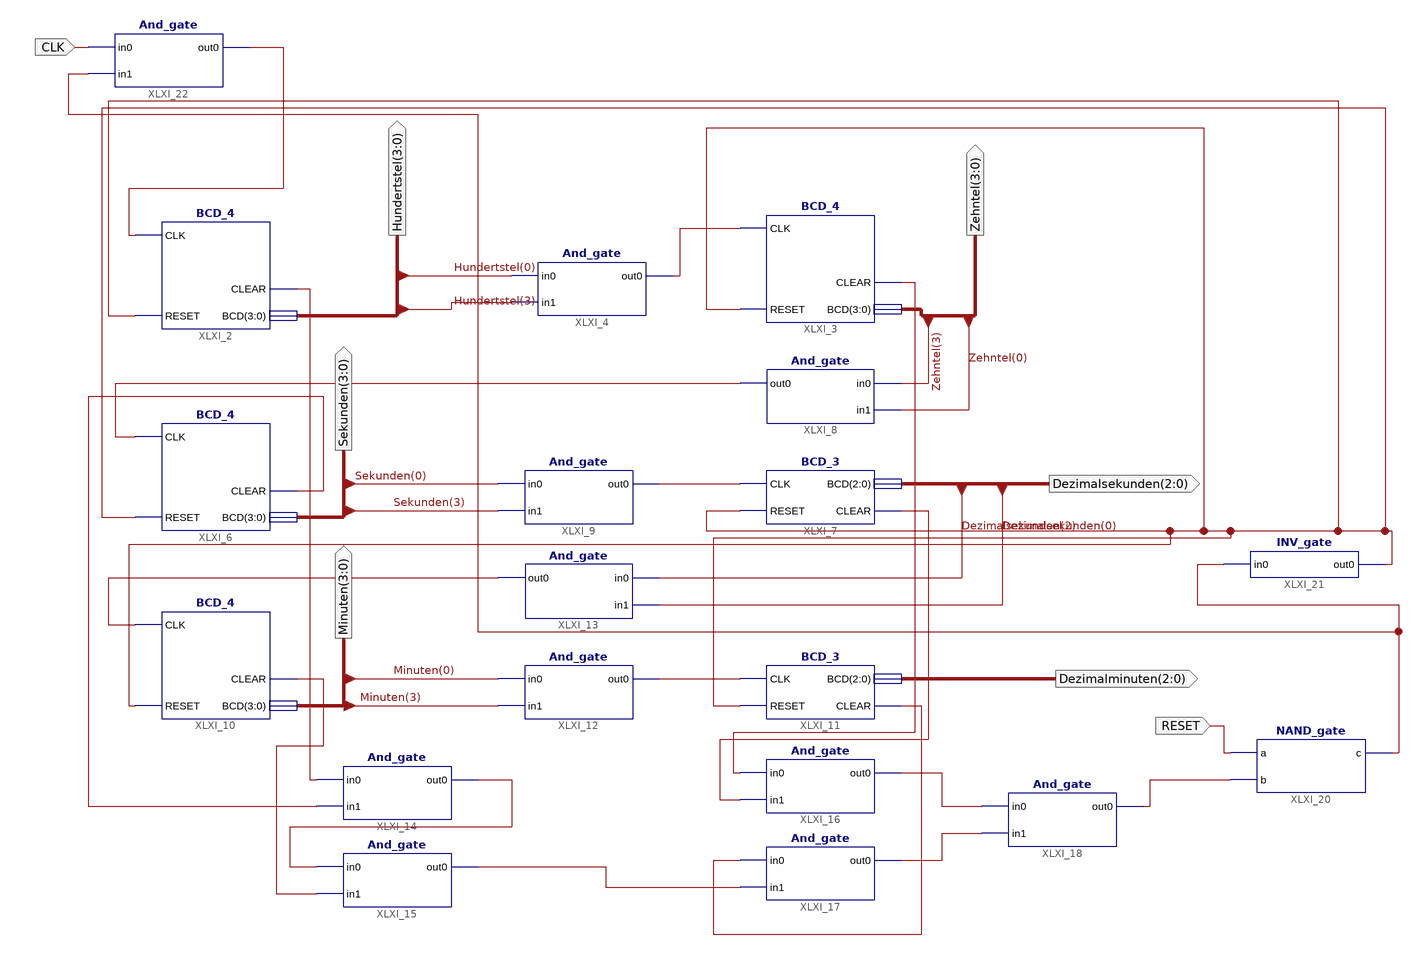
[diagram p0: schematic sheet 1]
// Xilinx ISE schematic Stoppuhr.sch (spartan6) as structural Verilog: 19 symbols, 8 ports
module Stoppuhr (
  input  RESET,
  input  CLK,
  output [3:0] Hundertstel,
  output [3:0] Zehntel,
  output [3:0] Sekunden,
  output [2:0] Dezimalsekunden,
  output [3:0] Minuten,
  output [2:0] Dezimalminuten
);

  wire CLEAR, XLXN_51, XLXN_52, XLXN_53, XLXN_54, XLXN_55, XLXN_56, XLXN_57, XLXN_58, XLXN_59, XLXN_60,
       XLXN_75, XLXN_76, XLXN_77, XLXN_78, XLXN_80, XLXN_102, XLXN_103, XLXN_106;

  BCD_4 XLXI_2 (.CLK(XLXN_103), .RESET(XLXN_102), .CLEAR(XLXN_51), .BCD(Hundertstel));
  BCD_4 XLXI_3 (.CLK(XLXN_75), .RESET(XLXN_102), .CLEAR(XLXN_56), .BCD(Zehntel));
  And_gate XLXI_4 (.in0(Hundertstel[0]), .in1(Hundertstel[3]), .out0(XLXN_75));
  BCD_4 XLXI_6 (.CLK(XLXN_76), .RESET(XLXN_102), .CLEAR(XLXN_52), .BCD(Sekunden));
  BCD_3 XLXI_7 (.CLK(XLXN_78), .RESET(XLXN_102), .BCD(Dezimalsekunden), .CLEAR(XLXN_57));
  And_gate XLXI_8 (.in0(Zehntel[3]), .in1(Zehntel[0]), .out0(XLXN_76));
  And_gate XLXI_9 (.in0(Sekunden[0]), .in1(Sekunden[3]), .out0(XLXN_78));
  BCD_4 XLXI_10 (.CLK(XLXN_80), .RESET(XLXN_102), .CLEAR(XLXN_53), .BCD(Minuten));
  BCD_3 XLXI_11 (.CLK(XLXN_77), .RESET(XLXN_102), .BCD(Dezimalminuten), .CLEAR(XLXN_58));
  And_gate XLXI_12 (.in0(Minuten[0]), .in1(Minuten[3]), .out0(XLXN_77));
  And_gate XLXI_13 (.in0(Dezimalsekunden[2]), .in1(Dezimalsekunden[0]), .out0(XLXN_80));
  And_gate XLXI_14 (.in0(XLXN_51), .in1(XLXN_52), .out0(XLXN_54));
  And_gate XLXI_15 (.in0(XLXN_54), .in1(XLXN_53), .out0(XLXN_55));
  And_gate XLXI_16 (.in0(XLXN_56), .in1(XLXN_57), .out0(XLXN_59));
  And_gate XLXI_17 (.in0(XLXN_58), .in1(XLXN_55), .out0(XLXN_60));
  And_gate XLXI_18 (.in0(XLXN_59), .in1(XLXN_60), .out0(CLEAR));
  NAND_gate XLXI_20 (.a(RESET), .b(CLEAR), .c(XLXN_106));
  INV_gate XLXI_21 (.in0(XLXN_106), .out0(XLXN_102));
  And_gate XLXI_22 (.in0(CLK), .in1(XLXN_106), .out0(XLXN_103));
endmodule
